# Altium schematic sheet WIFI_SWICH.SchDoc
size A4
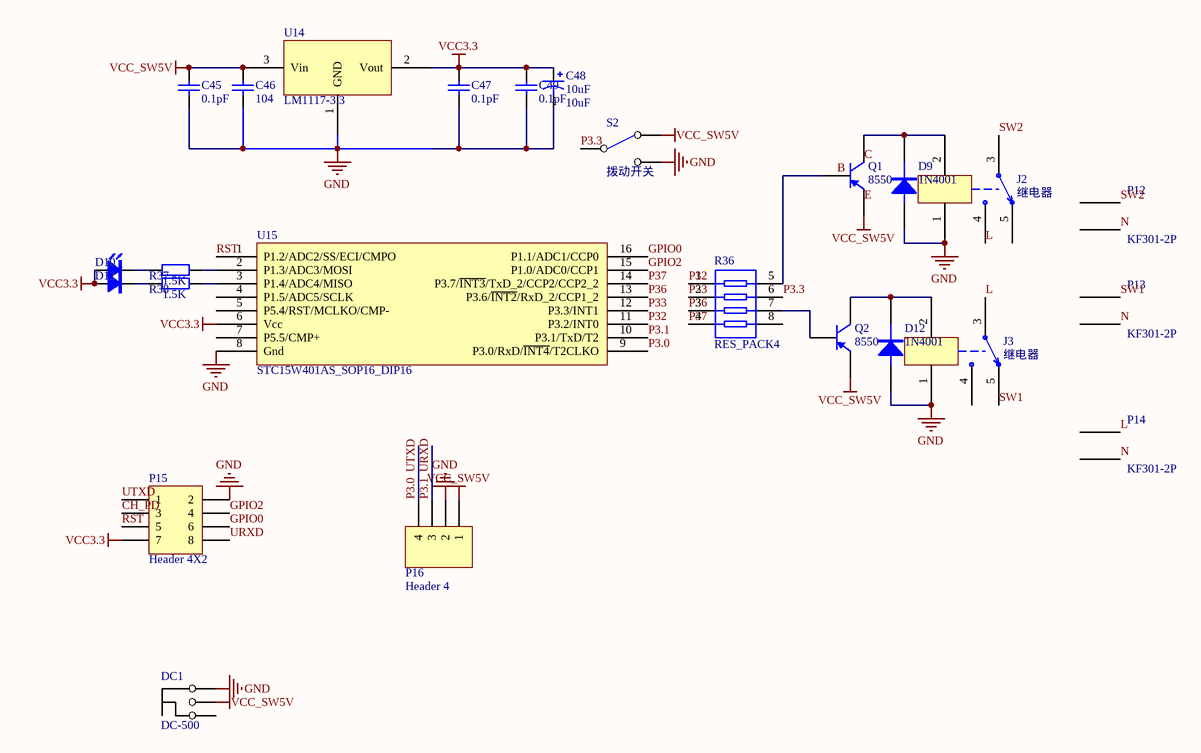
[diagram p0: WIFI_SWICH.SchDoc]

## Parts
C45  value 0.1pF  [LC-0603_C]  (hidden comment: Cap)
C46  value 104  [LC-1210_C]  (hidden comment: Cap)
C47  value 0.1pF  [LC-0603_C]  (hidden comment: Cap)
C48  10uF  [LC-1210_C]
C49  value 0.1pF  [LC-0603_C]  (hidden comment: Cap)
D9  1N4001  [SMA]
D10  LED  [LC-0805_LED]  (value not drawn)
D11  LED  [LC-0805_LED]  (value not drawn)
D12  1N4001  [SMA]
DC1  DC-500  [DC-005]
J2  继电器  [继电器]
J3  继电器  [继电器]
P12  KF301-2P  [KF301-2P]
P13  KF301-2P  [KF301-2P]
P14  KF301-2P  [KF301-2P]
P15  Header 4X2  [HDR2X4]
P16  Header 4  [HDR1X4]
Q1  8550  [LC-SOT-23]
Q2  8550  [LC-SOT-23]
R36  RES_PACK4  [RES4]
R37  value 1.5K  [LC-0603_R]  (hidden comment: Res2)
R38  value 1.5K  [LC-0603_R]  (hidden comment: Res2)
S2  拨动开关  [拨动开关]
U14  LM1117-3.3  [SOT223]
U15  STC15W401AS_SOP16_DIP16  [SOP16]

## Nets
GND: C45.2 C46.1 C47.2 C48.2 C49.2 D9.A D12.A DC1.1(GND) J2.1 J3.1 P15.2 P16.2 S2.3(NO1) U14.1(GND) U15.8(Gnd)
VCC3.3: C47.1 C48.1 C49.1 D10.1 D11.1 P15.7 U14.2(Vout) U15.6(Vcc)
VCC_SW5V: C45.1 C46.2 DC1.2(POW) P16.1 Q1.1(E) Q2.1(E) S2.2(NC1) U14.3(Vin)
CH_PD: P15.3
GPIO0: P15.6 U15.16(P1.1/ADC1/CCP0)
GPIO2: P15.4 U15.15(P1.0/ADC0/CCP1)
L: J2.4 J3.3 P14.0
N: P12.1 P13.1 P14.1
P3.0: P15.1 P16.4 U15.9(P3.0/RxD/~{INT4}/T2CLKO)  [also labelled UTXD]
P3.1: P15.8 P16.3 U15.10(P3.1/TxD/T2)  [also labelled URXD]
P3.3: R36.6 S2.1(COMMON1)
P32: R36.1 U15.11(P3.2/INT0)
P33: R36.2 U15.12(P3.3/INT1)
P36: R36.3 U15.13(P3.6/~{INT2}/RxD_2/CCP1_2)
P37: R36.4 U15.14(P3.7/~{INT3}/TxD_2/CCP2/CCP2_2)
RST: P15.5 U15.1(P1.2/ADC2/SS/ECI/CMPO)
SW1: J3.5 P13.0
SW2: J2.3 P12.0
NetD9_K: D9.K J2.2 Q1.3(C)
NetD10_2: D10.2 R37.1
NetD11_2: D11.2 R38.1
NetD12_K: D12.K J3.2 Q2.3(C)
NetQ1_2: Q1.2(B) R36.5
NetQ2_2: Q2.2(B) R36.7
NetR37_2: R37.2 U15.2(P1.3/ADC3/MOSI)
NetR38_2: R38.2 U15.3(P1.4/ADC4/MISO)

Not connected (* = marked no-connect by the designer): DC1 3(KEY); J2 5; J3 4; R36 8; U15 4(P1.5/ADC5/SCLK) 5(P5.4/RST/MCLKO/CMP-) 7(P5.5/CMP+)

## Notes on the sheet
- Labels drawn without touching a wire or pin: B, C, E

## Library data of the parts
C45-C47 C49 = Cap: Capacitor; Published: 8-Jun-2000; LatestRevisionDate: 17-Jul-2002; LatestRevisionNote: Re-released for DXP Platform.; PackageReference: RAD-0.3; Publisher: Altium Limited
C48 = Cap Pol1: Polarized Capacitor (Radial); Published: 8-Jun-2000; LatestRevisionDate: 17-Jul-2002; LatestRevisionNote: Re-released for DXP Platform.; PackageReference: RB7.6-15; Publisher: Altium Limited; Value: 10uF
D9 D12 = 1N4001: pin to pad: A>1 K>2
D10 D11 = LED: pin to pad: 1>K 2>A
DC1 = DC-500: pin to pad: 1>2 2>1
P12-P14 = 接线柱: pin to pad: 0>1 1>2
P15 = Header 4X2: Header, 4-Pin, Dual row; LatestRevisionDate: 17-Jul-2002; LatestRevisionNote: Re-released for DXP Platform.; Publisher: Altium Limited
P16 = Header 4: Header, 4-Pin; LatestRevisionDate: 17-Jul-2002; LatestRevisionNote: Re-released for DXP Platform.; Publisher: Altium Limited
Q1 Q2 = 2N3906: PNP General Purpose Amplifier; pin to pad: 1>2 2>1; Published: 8-Jun-2000; LatestRevisionDate: 15-Jan-2003; LatestRevisionNote: PCB Footprint 'BCY-W3/D4.7' replaced; DatasheetVersion: 1997; PackageVersion: Sep-1998; PackageReference: TO-92A; Publisher: Altium Limited; PackageDescription: TO, Flat Index; 3 In-Line, Axial Leads; Body Dia. 4.5mm; Leads 0.51 x 0.48 mm (max); ComponentLink1Description: Manufacturer Link; ComponentLink1URL: http://www.fairchildsemi.com/; ComponentLink2Description: Datasheet; ComponentLink2URL: http://www.fairchildsemi.com/ds/2N%2F2N3906.pdf
R37 R38 = Res2: Resistor; Published: 8-Jun-2000; LatestRevisionDate: 17-Jul-2002; LatestRevisionNote: Re-released for DXP Platform.; PackageReference: AXIAL-0.4; Publisher: Altium Limited